# Altium project NucciF.PrjPcb (part 1 of 2)
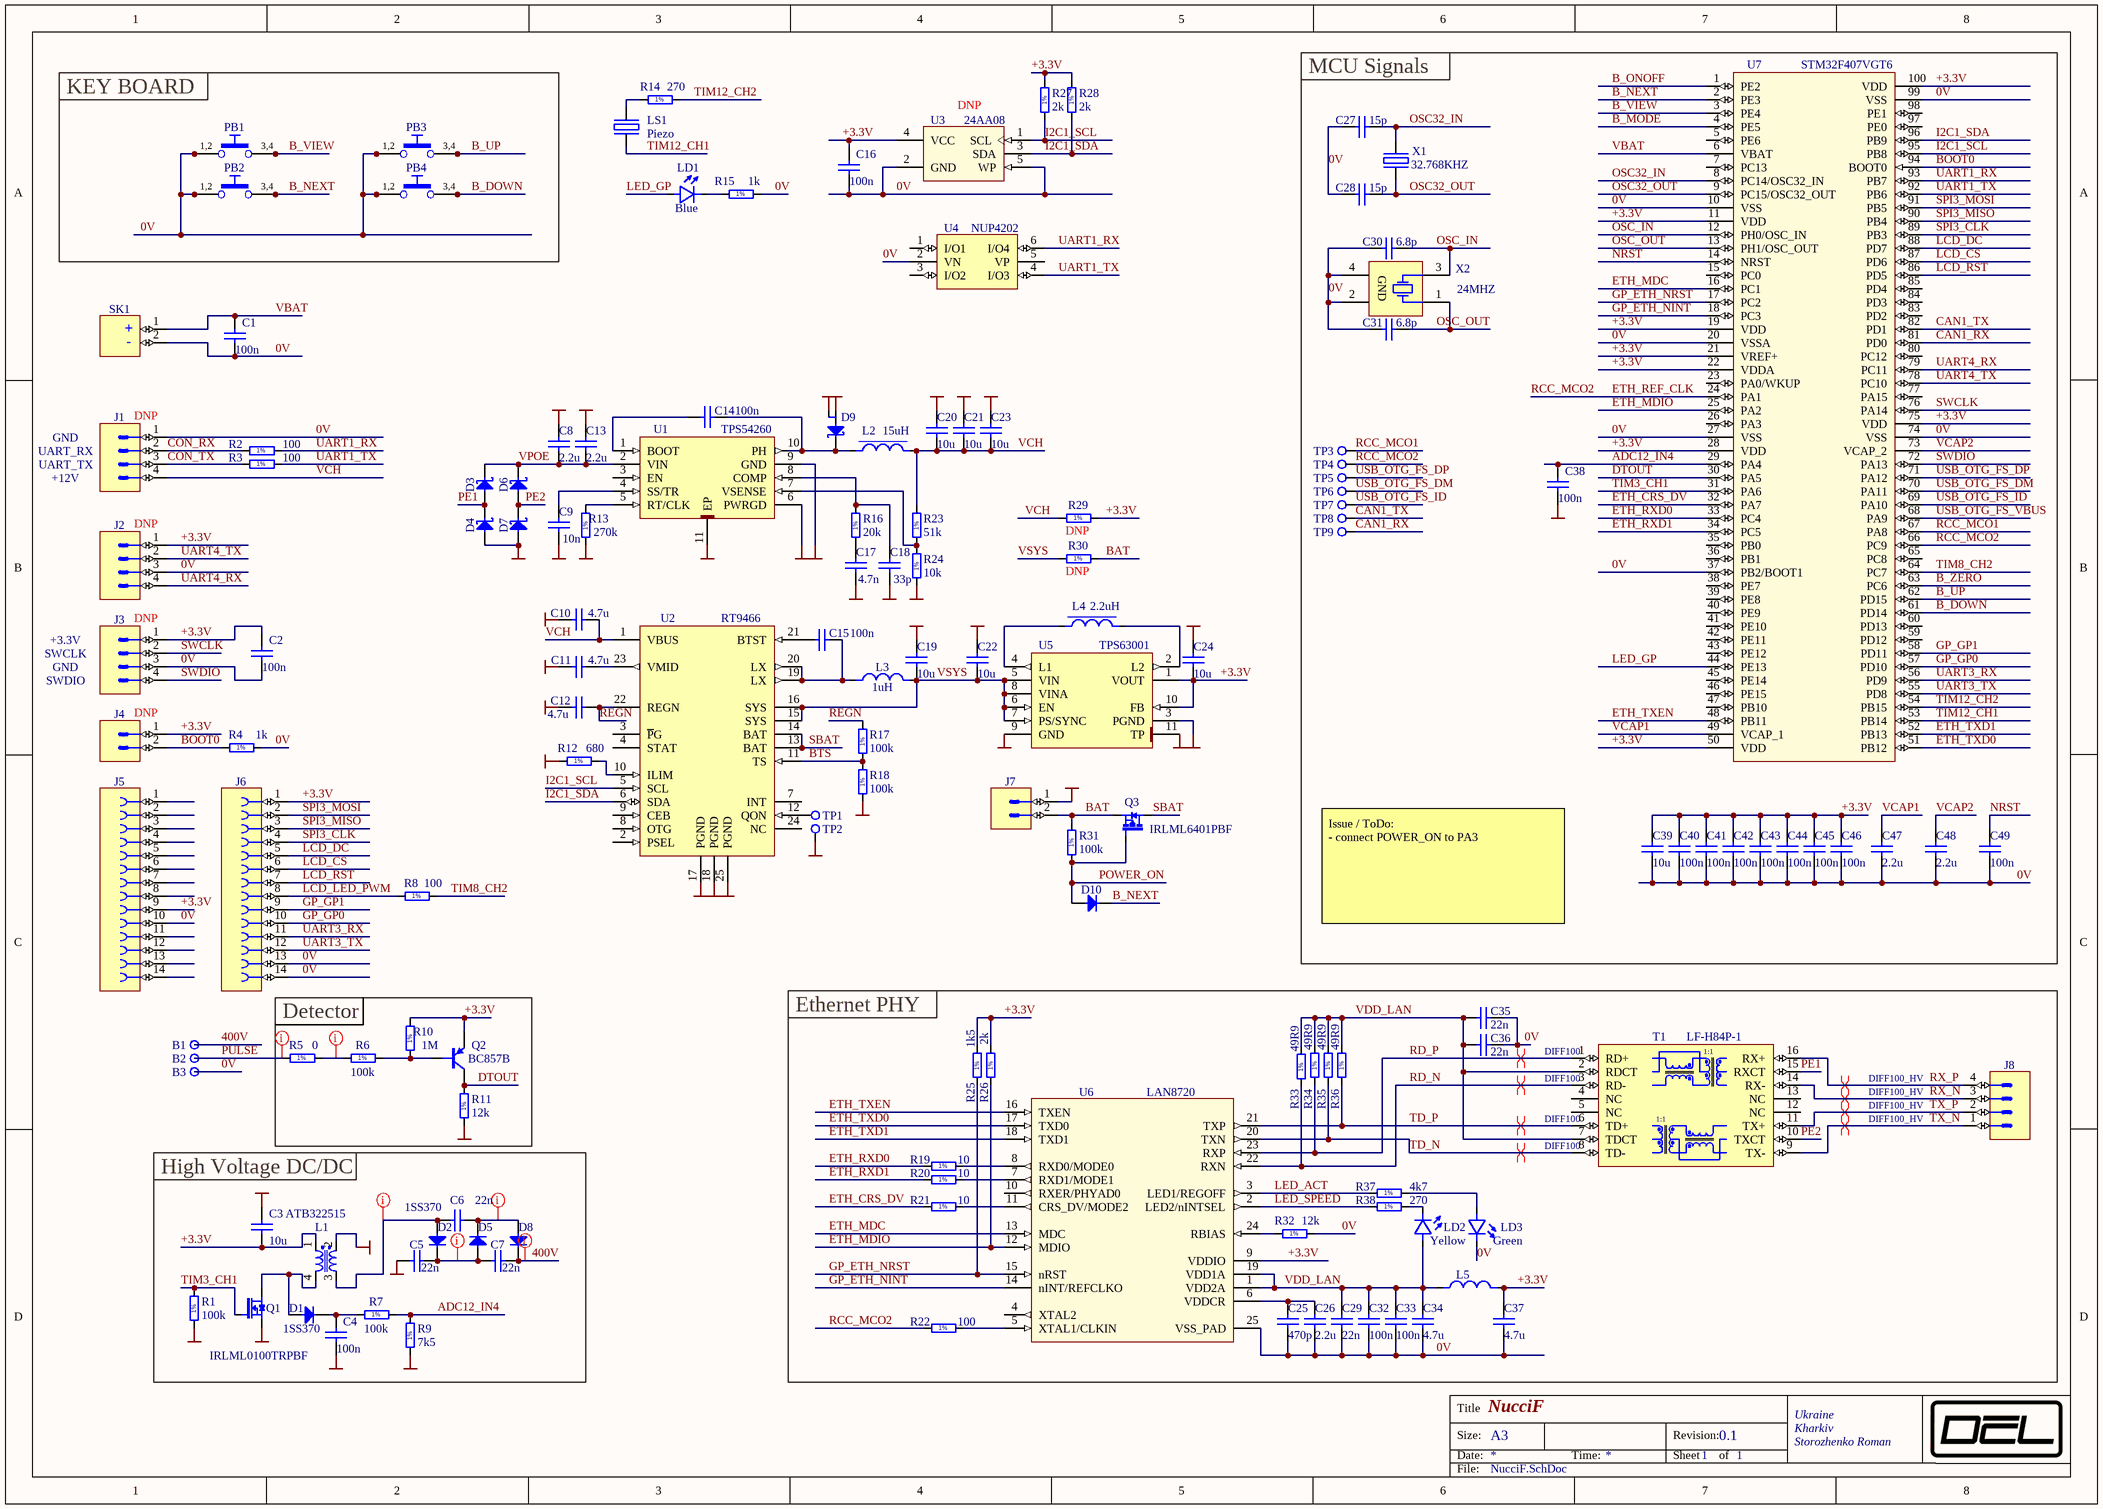
[diagram p0: NucciF.SchDoc]
1 sheet, 144 parts. Net scope: global (net labels, ports and power ports of the same name join across sheets).
Board file: NucciF.PcbDoc

## Sheet NucciF.SchDoc: NucciF
size A3; Author: Storozhenko Roman; CompanyName: D_EL; DrawnBy: Storozhenko Roman; Address1: Ukraine; Address2: Kharkiv; Revision: 0.1; SheetNumber: 1; SheetTotal: 1

### Parts
B1  V  [c150h100]  (value not drawn)
B2  P  [c150h100]  (value not drawn)
B3  G  [c150h100]  (value not drawn)
C1  100n  [CAPC1005X55N]
C2  100n  [CAPC1005X55N]
C3  10u  [CAPC1608X87N]
C4  100n  [CAPC1005X55N]
C5  22n  [CAPC2012X135N]
C6  22n  [CAPC2012X135N]
C7  22n  [CAPC2012X135N]
C8  2.2u  [CAPC3216X140N]
C9  10n  [CAPC1005X55N]
C10  4.7u  [CAPC1005X55N]
C11  4.7u  [CAPC1005X55N]
C12  4.7u  [CAPC1005X55N]
C13  2.2u  [CAPC3216X140N]
C14  100n  [CAPC1005X55N]
C15  100n  [CAPC1005X55N]
C16  100n  [CAPC1005X55N]
C17  4.7n  [CAPC1005X55N]
C18  33p  [CAPC1005X55N]
C19  10u  [CAPC1608X87N]
C20  10u  [CAPC1608X87N]
C21  10u  [CAPC1608X87N]
C22  10u  [CAPC1608X87N]
C23  10u  [CAPC1608X87N]
C24  10u  [CAPC1608X87N]
C25  470p  [CAPC1005X55N]
C26  2.2u  [CAPC1005X55N]
C27  15p  [CAPC1005X55N]
C28  15p  [CAPC1005X55N]
C29  22n  [CAPC1005X55N]
C30  6.8p  [CAPC1005X55N]
C31  6.8p  [CAPC1005X55N]
C32  100n  [CAPC1005X55N]
C33  100n  [CAPC1005X55N]
C34  4.7u  [CAPC1608X87N]
C35  22n  [CAPC1005X55N]
C36  22n  [CAPC1005X55N]
C37  4.7u  [CAPC1608X87N]
C38  100n  [CAPC1005X55N]
C39  10u  [CAPC1608X87N]
C40  100n  [CAPC1005X55N]
C41  100n  [CAPC1005X55N]
C42  100n  [CAPC1005X55N]
C43  100n  [CAPC1005X55N]
C44  100n  [CAPC1005X55N]
C45  100n  [CAPC1005X55N]
C46  100n  [CAPC1005X55N]
C47  2.2u  [CAPC1005X55N]
C48  2.2u  [CAPC1005X55N]
C49  100n  [CAPC1005X55N]
D1  1SS370  [SOT65P210X100-3N]
D2  1SS370  [SOT65P210X100-3N]
D3  MBR0540T1G  [SOD3716X135N]  (value not drawn)
D4  MBR0540T1G  [SOD3716X135N]  (value not drawn)
D5  1SS370  [SOT65P210X100-3N]  (value not drawn)
D6  MBR0540T1G  [SOD3716X135N]  (value not drawn)
D7  MBR0540T1G  [SOD3716X135N]  (value not drawn)
D8  1SS370  [SOT65P210X100-3N]  (value not drawn)
D9  SBRT15U100SP5  [SBRT15U100SP5]  (value not drawn)
D10  1N4148W  [SOD3715X145N]  (value not drawn)
J1  Mounted: DNP  [3M_2304-6111-TG]  (hidden comment: Header 4)
J2  Mounted: DNP  [3M_2304-6111-TG]  (hidden comment: Header 4)
J3  Mounted: DNP  [3M_2304-6111-TG]  (hidden comment: Header 4)
J4  Mounted: DNP  [3M_2302-6111-TG]  (hidden comment: Header 2)
J5  Socket 14  [3M_955114-6102-AR]  (value not drawn)
J6  Socket 14  [3M_955114-6102-AR]  (value not drawn)
J7  Header 2  [3M_2302-6111-TG]  (value not drawn)
J8  SPOX  [MOLEX_22-03-5045]  (value not drawn)
L1  ATB322515  [XFMR_ATB322515-0110-T000]
L2  15uH  [IND_VISHAY_IHLP-2525CZ]
L3  1uH  [IND_COILCRAFT_XAL4020]
L4  2.2uH  [VLS3010CX-1]
L5  2.2uH  [INDC2520X100N]  (value not drawn)
LD1  Blue  [LEDC1608X80N_BLUE]
LD2  Yellow  [LEDC1608X80N_YELLOW]
LD3  Green  [LEDC1608X80N_GREEN]
LS1  Piezo  [HPS13C]
PB1  Push Button  [PB_E-SWITCH_TL1105HF100Q]  (value not drawn)
PB2  Push Button  [PB_E-SWITCH_TL1105HF100Q]  (value not drawn)
PB3  Push Button  [PB_E-SWITCH_TL1105HF100Q]  (value not drawn)
PB4  Push Button  [PB_E-SWITCH_TL1105HF100Q]  (value not drawn)
Q1  IRLML0100TRPBF  [SOT95P237X112-3N]
Q2  BC857B  [SOT95P230X110-3N]
Q3  IRLML6401PBF  [SOT95P237X112-3N]
R1  100k  [RESC1005X40N]
R2  100  [RESC1005X40N]
R3  100  [RESC1005X40N]
R4  1k  [RESC1005X40N]
R5  0  [RESC2012X60N]
R6  100k  [RESC2012X60N]
R7  100k  [RESC1005X40N]
R8  100  [RESC1005X40N]
R9  7k5  [RESC1005X40N]
R10  1M  [RESC1005X40N]
R11  12k  [RESC1005X40N]
R12  680  [RESC1005X40N]
R13  270k  [RESC1005X40N]
R14  270  [RESC1005X40N]
R15  1k  [RESC1005X40N]
R16  20k  [RESC1005X40N]
R17  100k  [RESC1005X40N]
R18  100k  [RESC1005X40N]
R19  10  [RESC1005X40N]
R20  10  [RESC1005X40N]
R21  10  [RESC1005X40N]
R22  100  [RESC1005X40N]
R23  51k  [RESC1005X40N]
R24  10k  [RESC1005X40N]
R25  1k5  [RESC1005X40N]
R26  2k  [RESC1005X40N]
R27  2k  [RESC1005X40N]
R28  2k  [RESC1005X40N]
R29  Mounted: DNP  [RESC1005X40N]  (hidden comment: 0)
R30  Mounted: DNP  [RESC1005X40N]  (hidden comment: 0)
R31  100k  [RESC1005X40N]
R32  12k  [RESC1005X40N]
R33  49R9  [RESC1005X40N]
R34  49R9  [RESC1005X40N]
R35  49R9  [RESC1005X40N]
R36  49R9  [RESC1005X40N]
R37  4k7  [RESC1005X40N]
R38  270  [RESC1005X40N]
SK1  BH500  [EEMB_BH500]  (value not drawn)
T1  LF-H84P-1  [XFMR_LF-H84P]
TP1  Test Point  [TP_SMD_800]  (value not drawn)
TP2  GND  [TP_SMD_800]  (value not drawn)
TP3  Test Point  [TP_SMD_800]  (value not drawn)
TP4  Test Point  [TP_SMD_800]  (value not drawn)
TP5  Test Point  [TP_SMD_800]  (value not drawn)
TP6  Test Point  [TP_SMD_800]  (value not drawn)
TP7  Test Point  [TP_SMD_800]  (value not drawn)
TP8  Test Point  [TP_SMD_800]  (value not drawn)
TP9  Test Point  [TP_SMD_800]  (value not drawn)
U1  TPS54260  [SOP50P490X110-11N-R157X188]
U2  RT9466  [QFN50P400X400X100-25N-S270]
U3  24AA08  [SOT95P280X145-5N]
U4  NUP4202  Mounted: DNP  [SOT65P220X110-6N]
U5  TPS63001  [SON50P300X300X100-11N-R175X250]
U6  LAN8720  [QFN50P400X400X100-25N-S265]
U7  STM32F407VGT6  [QFP50P1600X1600X160-100N]
X1  32.768KHZ  [OSCCC150X320X80-2N]
X2  24MHZ  [OSCCC160X200X65-4N]

### Blocks framed on the sheet
MCU Signals: C27 C28 C30 C31 C38-C49 TP3-TP9 U7 X1 X2
KEY BOARD: PB1-PB4
Ethernet PHY: C25 C26 C29 C32-C37 J8 L5 LD2 LD3 R19-R22 R25 R26 R32-R38 T1 U6
Detector: Q2 R5 R6 R10 R11
High Voltage DC/DC: C3-C7 D1 D2 D5 D8 L1 Q1 R1 R7 R9

### Nets
0V: B3.1 C1.1 C2.1 C3.1 C4.1 C5.1 C8.2 C9.1 C10.1 C11.1 C12.1 C13.2 C16.1 C17.1 C18.1 C19.1 C20.2 C21.2 C22.1 C23.2 C24.1 C25.1 C26.1 C27.1 C28.1 C29.2 C30.1 C31.1 C32.1 C33.1 C34.1 C35.2 C36.2 C37.1 C38.1 C39.2 C40.1 C41.1 C42.1 C43.1 C44.1 C45.1 C46.1 C47.1 C48.1 C49.1 D4.2(A) D7.2(A) D9.1(A) D9.2(A) J1.1 J2.3 J3.3 J5.10 J6.13 J6.14 J7.1 L1.2 LD3.1(C) PB1.1 PB1.2 PB2.1 PB2.2 PB3.1 PB3.2 PB4.1 PB4.2 Q1.2(S) R1.1 R4.2 R9.1 R11.1 R12.1 R13.1 R15.2 R18.1 R24.1 R32.2 SK1.2 TP2.1 U1.6(PWRGD) U1.9(GND) U1.11(EP) U2.17(PGND) U2.18(PGND) U2.25(PGND) U3.2(GND) U3.5(WP) U4.2(VN) U5.3(PGND) U5.9(GND) U5.11(TP) U6.25(VSS_PAD) U7.10(VSS) U7.20(VSSA) U7.27(VSS) U7.37(PB2/BOOT1) U7.74(VSS) U7.99(VSS) X2.2(GND) X2.4(GND)
400V: B1.1 C7.2 D8.3(C)
+3.3V: C2.2 C3.2 C16.2 C24.2 C37.2 C39.1 C40.2 C41.2 C42.2 C43.2 C44.2 C45.2 C46.2 J2.1 J3.1 J4.1 J5.9 J6.1 L1.1 L5.2 Q2.2(E) R10.2 R25.2 R26.2 R27.2 R28.2 R29.2 U3.4(VCC) U5.1(VOUT) U5.10(FB) U6.9(VDDIO) U7.11(VDD) U7.19(VDD) U7.21(VREF+) U7.22(VDDA) U7.28(VDD) U7.50(VDD) U7.75(VDD) U7.100(VDD)
ADC12_IN4: C38.2 R7.2 R9.2 U7.29(PA4)
B_DOWN: PB4.3 PB4.4 U7.61(PD14)
B_MODE: U7.4(PE5)
B_NEXT: D10.1(C) PB2.3 PB2.4 U7.2(PE3)
B_ONOFF: U7.1(PE2)
B_UP: PB3.3 PB3.4 U7.62(PD15)
B_VIEW: PB1.3 PB1.4 U7.3(PE4)
B_ZERO: U7.63(PC6)
BAT: J7.2 Q3.2(S) R30.2 R31.2
BOOT0: J4.2 R4.1 U7.94(BOOT0)
BTS: R17.1 R18.2 U2.11(TS)
CAN1_RX: TP9.1 U7.81(PD0)
CAN1_TX: TP8.1 U7.82(PD1)
CON_RX: J1.2 R2.1
CON_TX: J1.3 R3.1
DTOUT: Q2.3(C) R11.2 U7.30(PA5)
ETH_CRS_DV: R21.1 U7.32(PA7)
ETH_MDC: U6.13(MDC) U7.16(PC1)
ETH_MDIO: R26.1 U6.12(MDIO) U7.25(PA2)
ETH_REF_CLK: R22.1 TP4.1 U7.24(PA1) U7.66(PC9)  [also labelled RCC_MCO2]
ETH_RXD0: R19.1 U7.33(PC4)
ETH_RXD1: R20.1 U7.34(PC5)
ETH_TXD0: U6.17(TXD0) U7.51(PB12)
ETH_TXD1: U6.18(TXD1) U7.52(PB13)
ETH_TXEN: U6.16(TXEN) U7.48(PB11)
GP_ETH_NINT: U6.14(nINT/REFCLKO) U7.18(PC3)
GP_ETH_NRST: R25.1 U6.15(nRST) U7.17(PC2)
GP_GP0: J6.10 U7.57(PD10)
GP_GP1: J6.9 U7.58(PD11)
I2C1_SCL: R27.1 U2.5(SCL) U3.1(SCL) U7.95(PB8)
I2C1_SDA: R28.1 U2.6(SDA) U3.3(SDA) U7.96(PB9)
LCD_CS: J6.6 U7.87(PD6)
LCD_DC: J6.5 U7.88(PD7)
LCD_LED_PWM: J6.8 R8.1
LCD_RST: J6.7 U7.86(PD5)
LED_ACT: R37.1 U6.3(LED1/REGOFF)
LED_GP: LD1.2(A) U7.44(PE13)
LED_SPEED: R38.1 U6.2(LED2/nINTSEL)
NRST: C49.2 U7.14(NRST)
OSC32_IN: C27.2 U7.8(PC14/OSC32_IN) X1.2(OSC2)
OSC32_OUT: C28.2 U7.9(PC15/OSC32_OUT) X1.1(OSC1)
OSC_IN: C30.2 U7.12(PH0/OSC_IN) X2.3(X)
OSC_OUT: C31.2 U7.13(PH1/OSC_OUT) X2.1(X)
PE1: D3.2(A) D4.1(C) T1.15(RXCT)
PE2: D6.2(A) D7.1(C) T1.10(TXCT)
POWER_ON: D10.2(A) Q3.1(G) R31.1
PULSE: B2.1 R5.1
RCC_MCO1: TP3.1 U7.67(PA8)
RD_N: R33.1 T1.3(RD-) U6.22(RXN)
RD_P: R34.1 T1.1(RD+) U6.23(RXP)
REGN: C12.2 R17.2 U2.22(REGN)
RX_N: J8.3 T1.14(RX-)
RX_P: J8.4 T1.16(RX+)
SBAT: Q3.3(D) U2.13(BAT) U2.14(BAT)
SPI3_CLK: J6.4 U7.89(PB3)
SPI3_MISO: J6.3 U7.90(PB4)
SPI3_MOSI: J6.2 U7.91(PB5)
SWCLK: J3.2 U7.76(PA14)
SWDIO: J3.4 U7.72(PA13)
TD_N: R35.1 T1.8(TD-) U6.20(TXN)
TD_P: R36.1 T1.6(TD+) U6.21(TXP)
TIM3_CH1: Q1.1(G) R1.2 U7.31(PA6)
TIM8_CH2: R8.2 U7.64(PC7)
TIM12_CH1: LS1.1(OSC1) U7.53(PB14)
TIM12_CH2: R14.2 U7.54(PB15)
TX_N: J8.1 T1.9(TX-)
TX_P: J8.2 T1.11(TX+)
UART1_RX: R2.2 U4.6(I/O4) U7.93(PB7)
UART1_TX: R3.2 U4.4(I/O3) U7.92(PB6)
UART3_RX: J6.11 U7.56(PD9)
UART3_TX: J6.12 U7.55(PD8)
UART4_RX: J2.4 U7.79(PC11)
UART4_TX: J2.2 U7.78(PC10)
USB_OTG_FS_DM: TP6.1 U7.70(PA11)
USB_OTG_FS_DP: TP5.1 U7.71(PA12)
USB_OTG_FS_ID: TP7.1 U7.69(PA10)
USB_OTG_FS_VBUS: U7.68(PA9)
VBAT: C1.2 SK1.1 U7.6(VBAT)
VCAP1: C47.2 U7.49(VCAP_1)
VCAP2: C48.2 U7.73(VCAP_2)
VCH: C10.2 C20.1 C21.1 C23.1 J1.4 L2.2 R23.2 R29.1 U2.1(VBUS)
VDD_LAN: C29.1 C32.2 C33.2 C34.2 C35.1 C36.1 L5.1 LD2.2(A) R33.2 R34.2 R35.2 R36.2 T1.2(RDCT) T1.7(TDCT) U6.1(VDD2A) U6.19(VDD1A)
VPOE: C8.1 C13.1 D3.1(C) D6.1(C) U1.2(VIN)
VSYS: C19.2 C22.2 L3.2 R30.1 U2.15(SYS) U2.16(SYS) U5.5(VIN) U5.6(EN) U5.7(PS/SYNC) U5.8(VINA)
NetC4_2: C4.2 D1.3(C) R7.1
NetC5_2: C5.2 C7.1 D2.3(C) D5.1(A)
NetC6_1: C6.1 D2.1(A) L1.3
NetC6_2: C6.2 D5.3(C) D8.1(A)
NetC9_2: C9.2 U1.4(SS/TR)
NetC11_2: C11.2 U2.23(VMID)
NetC14_1: C14.1 U1.1(BOOT)
NetC14_2: C14.2 D9.3(C) L2.1 U1.10(PH)
NetC15_1: C15.1 U2.21(BTST)
NetC15_2: C15.2 L3.1 U2.19(LX) U2.20(LX)
NetC17_2: C17.2 R16.1
NetC18_2: C18.2 R16.2 U1.8(COMP)
NetC25_2: C25.2 C26.2 U6.6(VDDCR)
NetD1_1: D1.1(A) L1.4 Q1.3(D)
NetL4_1: L4.1 U5.4(L1)
NetL4_2: L4.2 U5.2(L2)
NetLD1_1: LD1.1(C) R15.1
NetLD2_1: LD2.1(C) R38.2
NetLD3_2: LD3.2(A) R37.2
NetLS1_2: LS1.2(OSC2) R14.1
NetQ2_1: Q2.1(B) R6.2 R10.1
NetR5_2: R5.2 R6.1
NetR12_2: R12.2 U2.10(ILIM)
NetR13_2: R13.2 U1.5(RT/CLK)
NetR19_2: R19.2 U6.8(RXD0/MODE0)
NetR20_2: R20.2 U6.7(RXD1/MODE1)
NetR21_2: R21.2 U6.11(CRS_DV/MODE2)
NetR22_2: R22.2 U6.5(XTAL1/CLKIN)
NetR23_1: R23.1 R24.2 U1.7(VSENSE)
NetR32_1: R32.1 U6.24(RBIAS)
NetTP1_1: TP1.1 U2.12(QON)

Not connected (* = marked no-connect by the designer): J5 1 2 3 4 5 6 7 8 11 12 13 14; T1 4(NC) 5(NC) 12(NC) 13(NC); U1 3(EN); U2 2(PSEL) 3(~{P}G) 4(STAT) 7(INT) 8(OTG) 9(CEB) 24(NC); U4 1(I/O1) 3(I/O2) 5(VP); U6 4(XTAL2) 10(RXER/PHYAD0); U7 5(PE6) 7(PC13) 15(PC0) 23(PA0/WKUP) 26(PA3) 35(PB0) 36(PB1) 38(PE7) 39(PE8) 40(PE9) 41(PE10) 42(PE11) 43(PE12) 45(PE14) 46(PE15) 47(PB10) 59(PD12) 60(PD13) 65(PC8) 77(PA15) 80(PC12) 83(PD2) 84(PD3) 85(PD4) 97(PE0) 98(PE1)

### Layout directives
differential pair; net class DIFF100: RD_N, RD_P, TD_N, TD_P
differential pair; net class DIFF100_HV: RX_N, RX_P, TX_N, TX_P
net class HV: 400V, NetC5_2, NetC6_1, NetC6_2, NetR5_2, PULSE

### Notes on the sheet
- GND
- (near J1) UART_RX
- +12V
- (near J1) UART_TX
- +3.3V
- SWCLK
- SWDIO
- Issue / ToDo:
  - connect POWER_ON to PA3
- Title
- Size:
- Date:
- A3
- Time:
- Revision:
- Sheet
- of
- File:
- (in symbol EEMB_BH500) +; -
- (in symbol PB_E-SWITCH_TL1105HF100Q) 1,2; 3,4
- (in symbol R0402_0R_JUMPER) 1%
- (in symbol R0402_1K5_1%_0.0625W_100PPM) 1%
- (in symbol R0402_1K_1%_0.0625W_100PPM) 1%
- (in symbol R0402_1M_1%_0.0625W_100PPM) 1%
- (in symbol R0402_2K_1%_0.0625W_100PPM) 1%
- (in symbol R0402_4K7_1%_0.0625W_100PPM) 1%
- (in symbol R0402_7K5_1%_0.0625W_100PPM) 1%
- (in symbol R0402_10K_1%_0.0625W_100PPM) 1%
- (in symbol R0402_10R_1%_0.0625W_200PPM) 1%
- (in symbol R0402_12K_1%_0.0625W_100PPM) 1%
- (in symbol R0402_20K_1%_0.0625W_100PPM) 1%
- (in symbol R0402_49R9_1%_0.0625W_100PPM) 1%
- (in symbol R0402_51K_1%_0.0625W_100PPM) 1%
- (in symbol R0402_100K_1%_0.0625W_100PPM) 1%
- (in symbol R0402_100R_1%_0.0625W_100PPM) 1%
- (in symbol R0402_270K_1%_0.0625W_100PPM) 1%
- (in symbol R0402_270R_1%_0.0625W_100PPM) 1%
- (in symbol R0402_680R_1%_0.0625W_100PPM) 1%
- (in symbol R0805_0R_JUMPER) 1%
- (in symbol R0805_100K_1%_0.125W_100PPM) 1%
- (in symbol XFMR_LF-H84P-1) 1:1